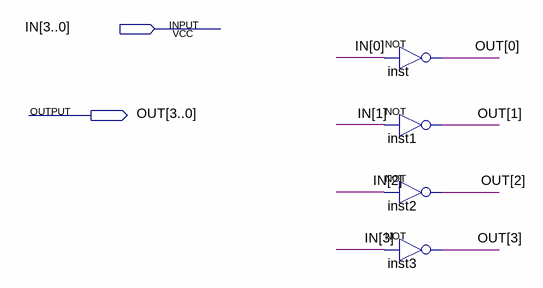
[diagram p0: schematic sheet]
// Quartus schematic NOT_4BITS.bdf as structural Verilog: 4 symbols, 2 pins
module NOT_4BITS (
  input  [3:0] IN,
  output [3:0] OUT
);

  not inst (OUT[0], IN[0]);
  not inst1 (OUT[1], IN[1]);
  not inst2 (OUT[2], IN[2]);
  not inst3 (OUT[3], IN[3]);
endmodule
